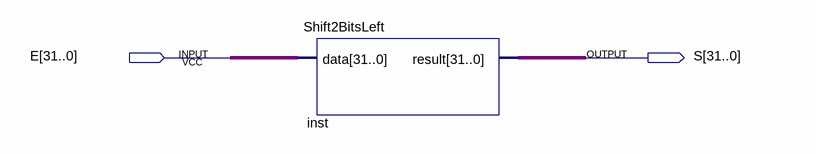
[diagram p0: schematic sheet]
// Quartus schematic TesteShift2BitsLeft.bdf as structural Verilog: 1 symbols, 2 pins
module TesteShift2BitsLeft (
  input  [31:0] E,
  output [31:0] S
);

  Shift2BitsLeft inst (.data(E), .result(S));
endmodule
